# EasyEDA Pro project ProPrj_SBL_V1_2026-03-12.epro

# Schematic Schematic1
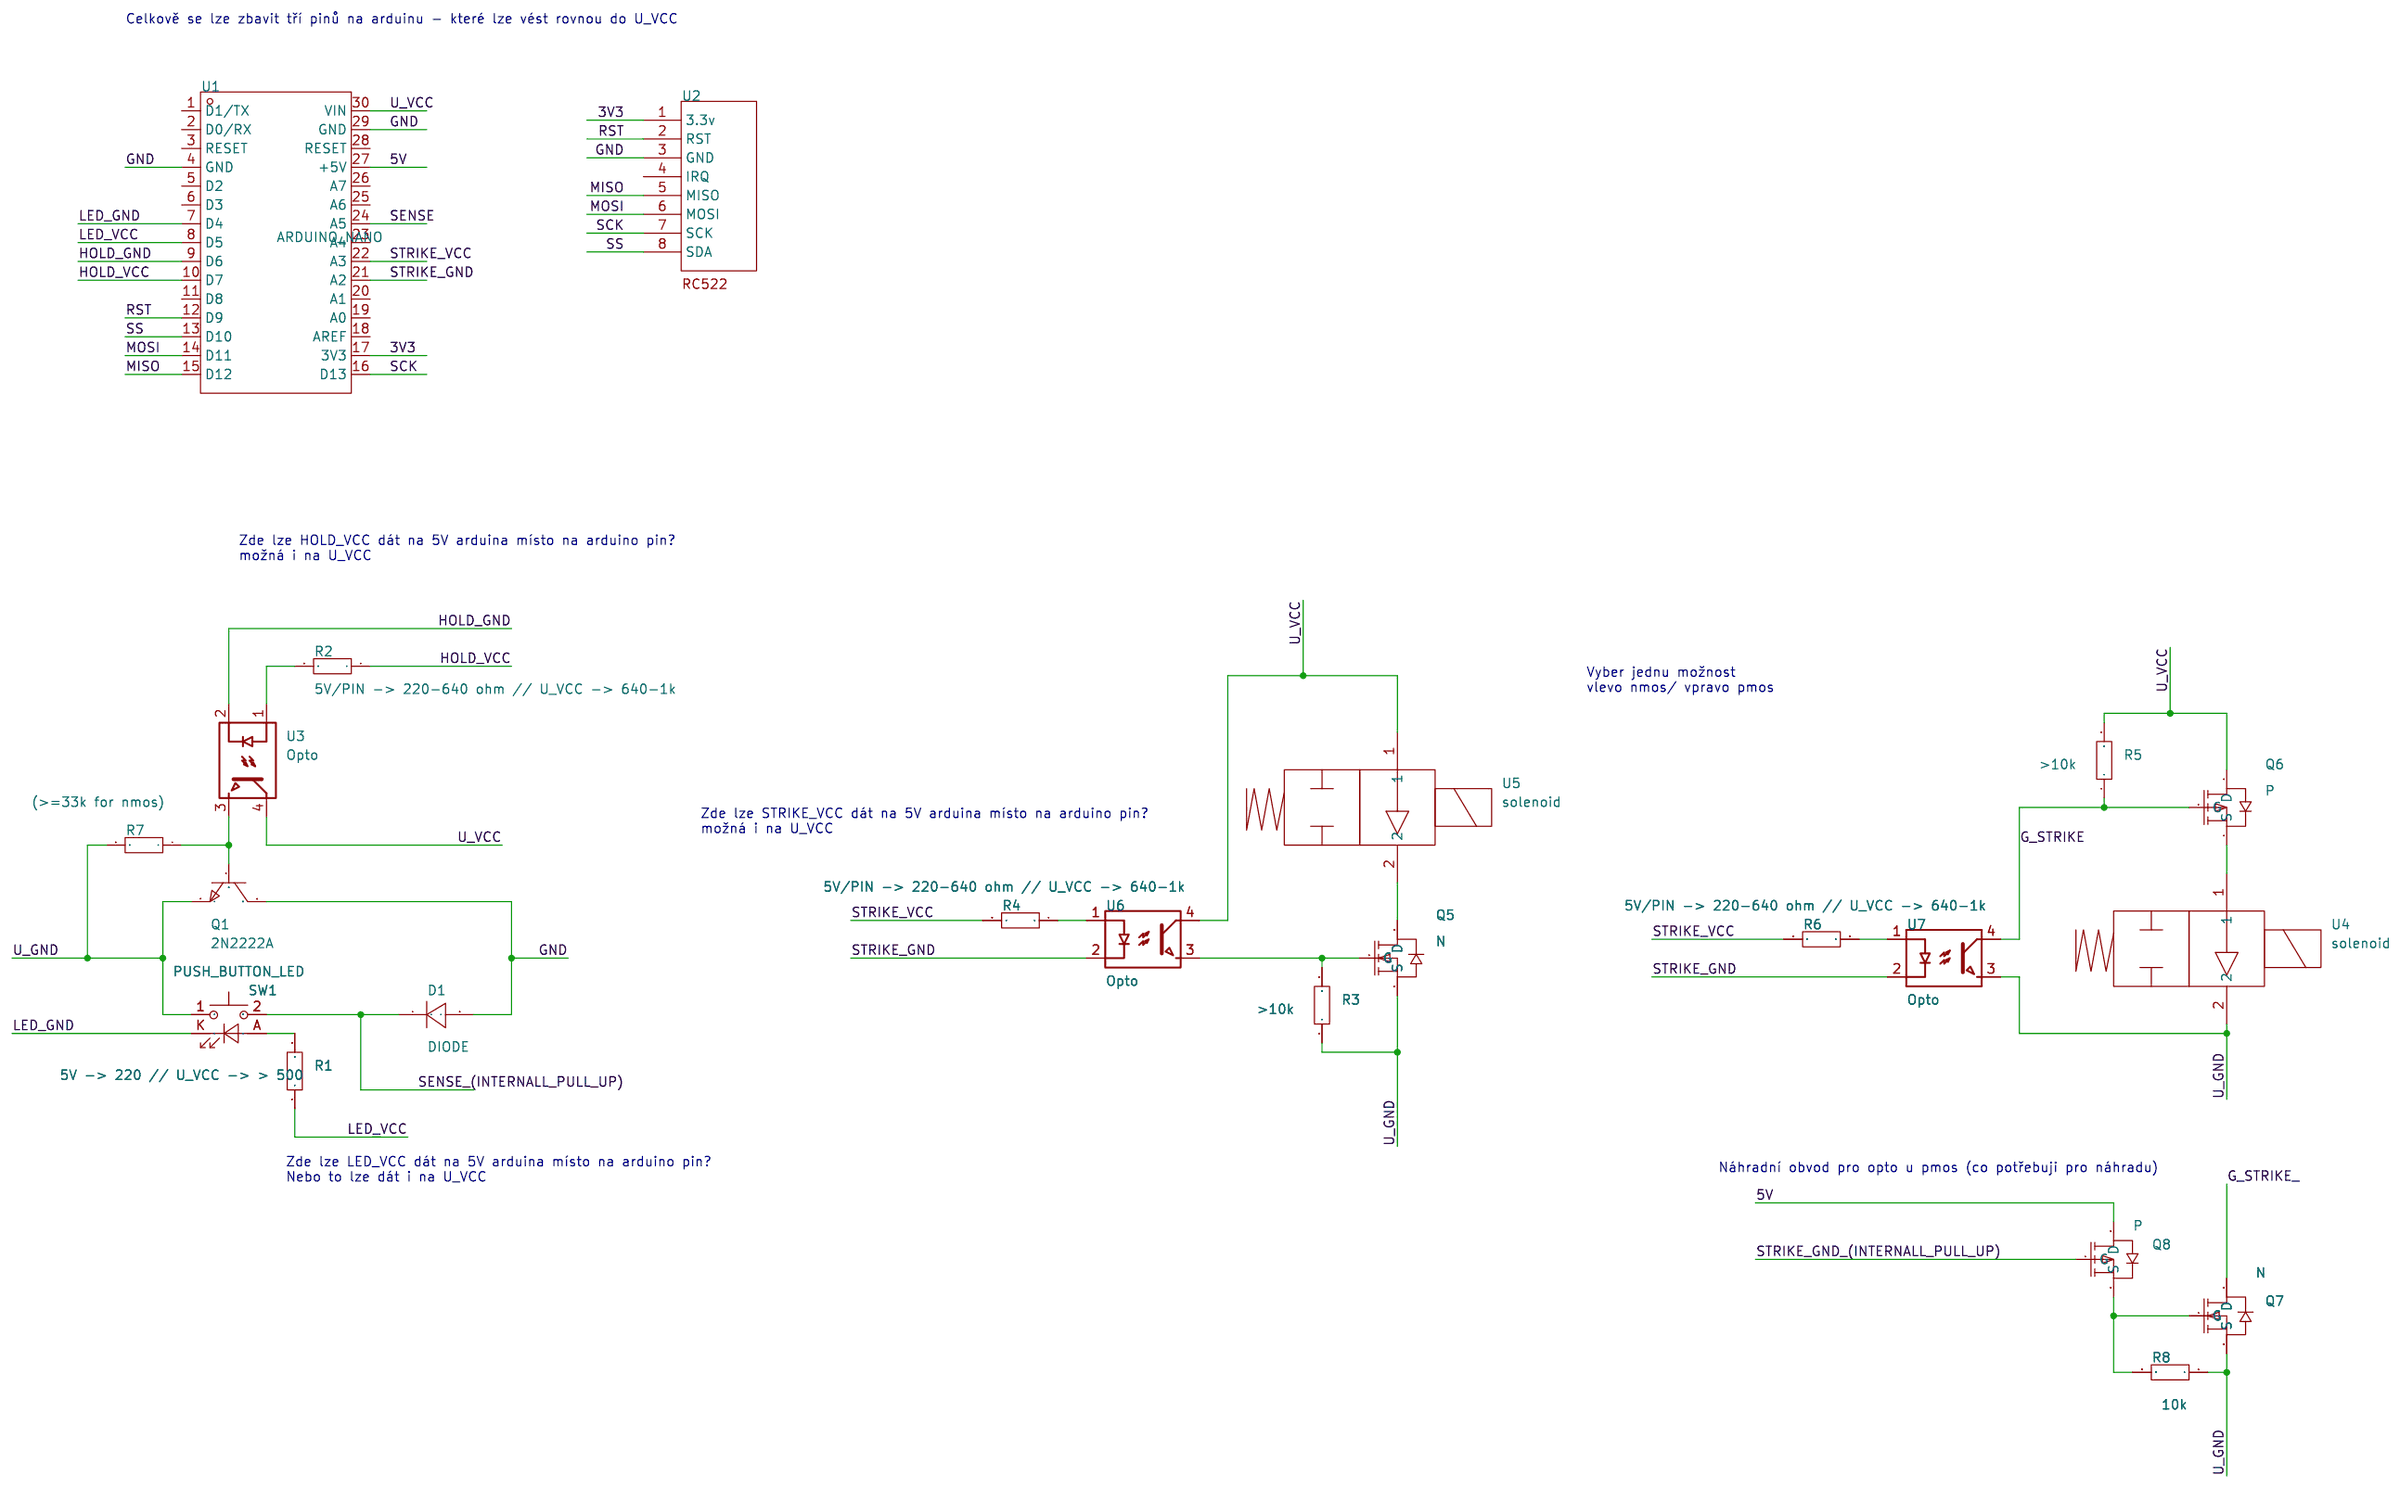
[diagram p0: schematic sheet]

## Parts
D1  DIODE
Q1  2N2222A  [SOT-23-3_L2.9-W1.3-P1.90-LS2.4-BR]
Q5  N  [SOT-23-3_L2.9-W1.3-P1.90-LS2.4-BR]
Q6  P  [SOT-23_L2.9-W1.3-P1.90-LS2.4-BR]
Q7  N  [SOT-23-3_L2.9-W1.3-P1.90-LS2.4-BR]
Q8  P  [SOT-23_L2.9-W1.3-P1.90-LS2.4-BR]
R1  5V -> 220 // U_VCC -> > 500  [R0603]
R2  5V/PIN -> 220-640 ohm // U_VCC -> 640-1k  [R0603]
R3  >10k  [R0603]
R4  5V/PIN -> 220-640 ohm // U_VCC -> 640-1k  [R0603]
R5  >10k  [R0603]
R6  5V/PIN -> 220-640 ohm // U_VCC -> 640-1k  [R0603]
R7  (>=33k for nmos)  [R0603]
R8  10k  [R0603]
SW1  PUSH_BUTTON_LED
U1  ARDUINO_NANO  [ARDUINO_NANO_SMD_V3]
U2  -  [RC522]
U3  Opto
U4  solenoid
U5  solenoid
U6  Opto
U7  Opto

## Library data of the parts
D1 = DIODE: Supplier: LCSC; Manufacturer: MDD; Manufacturer Part: M7; Supplier Part: C95872; JLCPCB Part Class: Basic Part; Origin Footprint 2: RES-TH_BD3.3-L9.0-P13.00-D0.6
Q1 = SS8050_C2150: Transistor Type: Collector-Emitter Breakdown Voltage (Vceo): Collector Current (Ic): Power Dissipation (Pd): Collector Cut-Off Current (Icbo):100nA Collector-Emitter Saturation Voltage (VCE(sat)@Ic,Ib):500mV@800mA,80mA DC Current Gain (hFE@Ic,Vce):200@100; LCSC Part Name: NPN 25V 1.5A; Supplier Part: C2150; Manufacturer: CJ(江苏长电/长晶); Supplier Footprint: SOT-23-3; JLCPCB Part Class: Basic Part; Datasheet: https://atta.szlcsc.com/upload/public/pdf/source/20140809/1457707209319.pdf; Supplier: LCSC; Collector Cut-Off Current (Icbo): 100nA; Collector-Emitter Saturation Voltage (VCE(sat)@Ic,Ib): 500mV@800mA,80mA; DC Current Gain (hFE@Ic,Vce): 200@100mA,1V; Transition Frequency (fT): 100MHz; Operating Temperature: +150℃@(Tj)
Q5 Q7 = N_MOS: Supplier Footprint: SOT-23
Q6 Q8 = P_MOS: Supplier Footprint: SOT-23-3L
R1-R8 = Res_0603: Supplier Footprint: 0603
SW1 = PUSH_BUTTON_LED_12MM
U1 = ARDUINO_NANO_SMD_V3: Supplier Part: C9900017879; JLCPCB Part Class: Extended Part; Supplier: LCSC
U2 = RC522: _: 3
U3 U6 U7 = Opto: license: https://www.gnu.org/licenses/lgpl-2.1.html
U4 U5 = solenoid

## Nets
3V3: U1.17(3V3) U2.1(3.3v)
5V: Q8.3(D) U1.27(+5V)
GND: D1.2(A) Q1.3(C) U1.4(GND) U1.29(GND) U2.3(GND)
G_STRIKE: Q6.1(G) R5.1 U7.4
G_STRIKE_: Q7.3(D)
HOLD_GND: U1.9(D6) U3.2
HOLD_VCC: R2.1 U1.10(D7)
LED_GND: SW1.K U1.7(D4)
LED_VCC: R1.1 U1.8(D5)
MISO: U1.15(D12) U2.5(MISO)
MOSI: U1.14(D11) U2.6(MOSI)
RST: U1.12(D9) U2.2(RST)
SCK: U1.16(D13) U2.7(SCK)
SENSE: U1.24(A5)
SENSE_(INTERNALL_PULL_UP): D1.1(K) SW1.2
SS: U1.13(D10) U2.8(SDA)
STRIKE_GND: U1.21(A2) U6.2 U7.2
STRIKE_GND_(INTERNALL_PULL_UP): Q8.1(G)
STRIKE_VCC: R4.2 R6.2 U1.22(A3)
U_GND: Q1.2(E) Q5.2(S) Q7.2(S) R3.1 R7.2 R8.1 SW1.1 U4.2 U7.3
U_VCC: Q6.3(D) R5.2 U1.30(VIN) U3.4 U5.1 U6.4
Net-(Q1-1): Q1.1(B) R7.1 U3.3
Net-(Q5-1): Q5.1(G) R3.2 U6.3
Net-(Q5-3): Q5.3(D) U5.2
Net-(Q6-2): Q6.2(S) U4.1
Net-(Q7-1): Q7.1(G) Q8.2(S) R8.2
Net-(R1-2): R1.2 SW1.A
Net-(R2-2): R2.2 U3.1
Net-(R4-1): R4.1 U6.1
Net-(R6-1): R6.1 U7.1

Not connected (* = marked no-connect by the designer): U1 1(D1/TX) 2(D0/RX) 3(RESET) 5(D2) 6(D3) 11(D8) 18(AREF) 19(A0) 20(A1) 23(A4) 25(A6) 26(A7) 28(RESET); U2 4(IRQ)

## Notes on the sheet
- Celkově se lze zbavit tří pinů na arduinu - které lze vést rovnou do U_VCC
- Zde lze HOLD_VCC dát na 5V arduina místo na arduino pin?
  možná i na U_VCC
- Vyber jednu možnost
  vlevo nmos/ vpravo pmos
- Zde lze STRIKE_VCC dát na 5V arduina místo na arduino pin?
  možná i na U_VCC
- Zde lze LED_VCC dát na 5V arduina místo na arduino pin?
  Nebo to lze dát i na U_VCC
- Náhradní obvod pro opto u pmos (co potřebuji pro náhradu)
